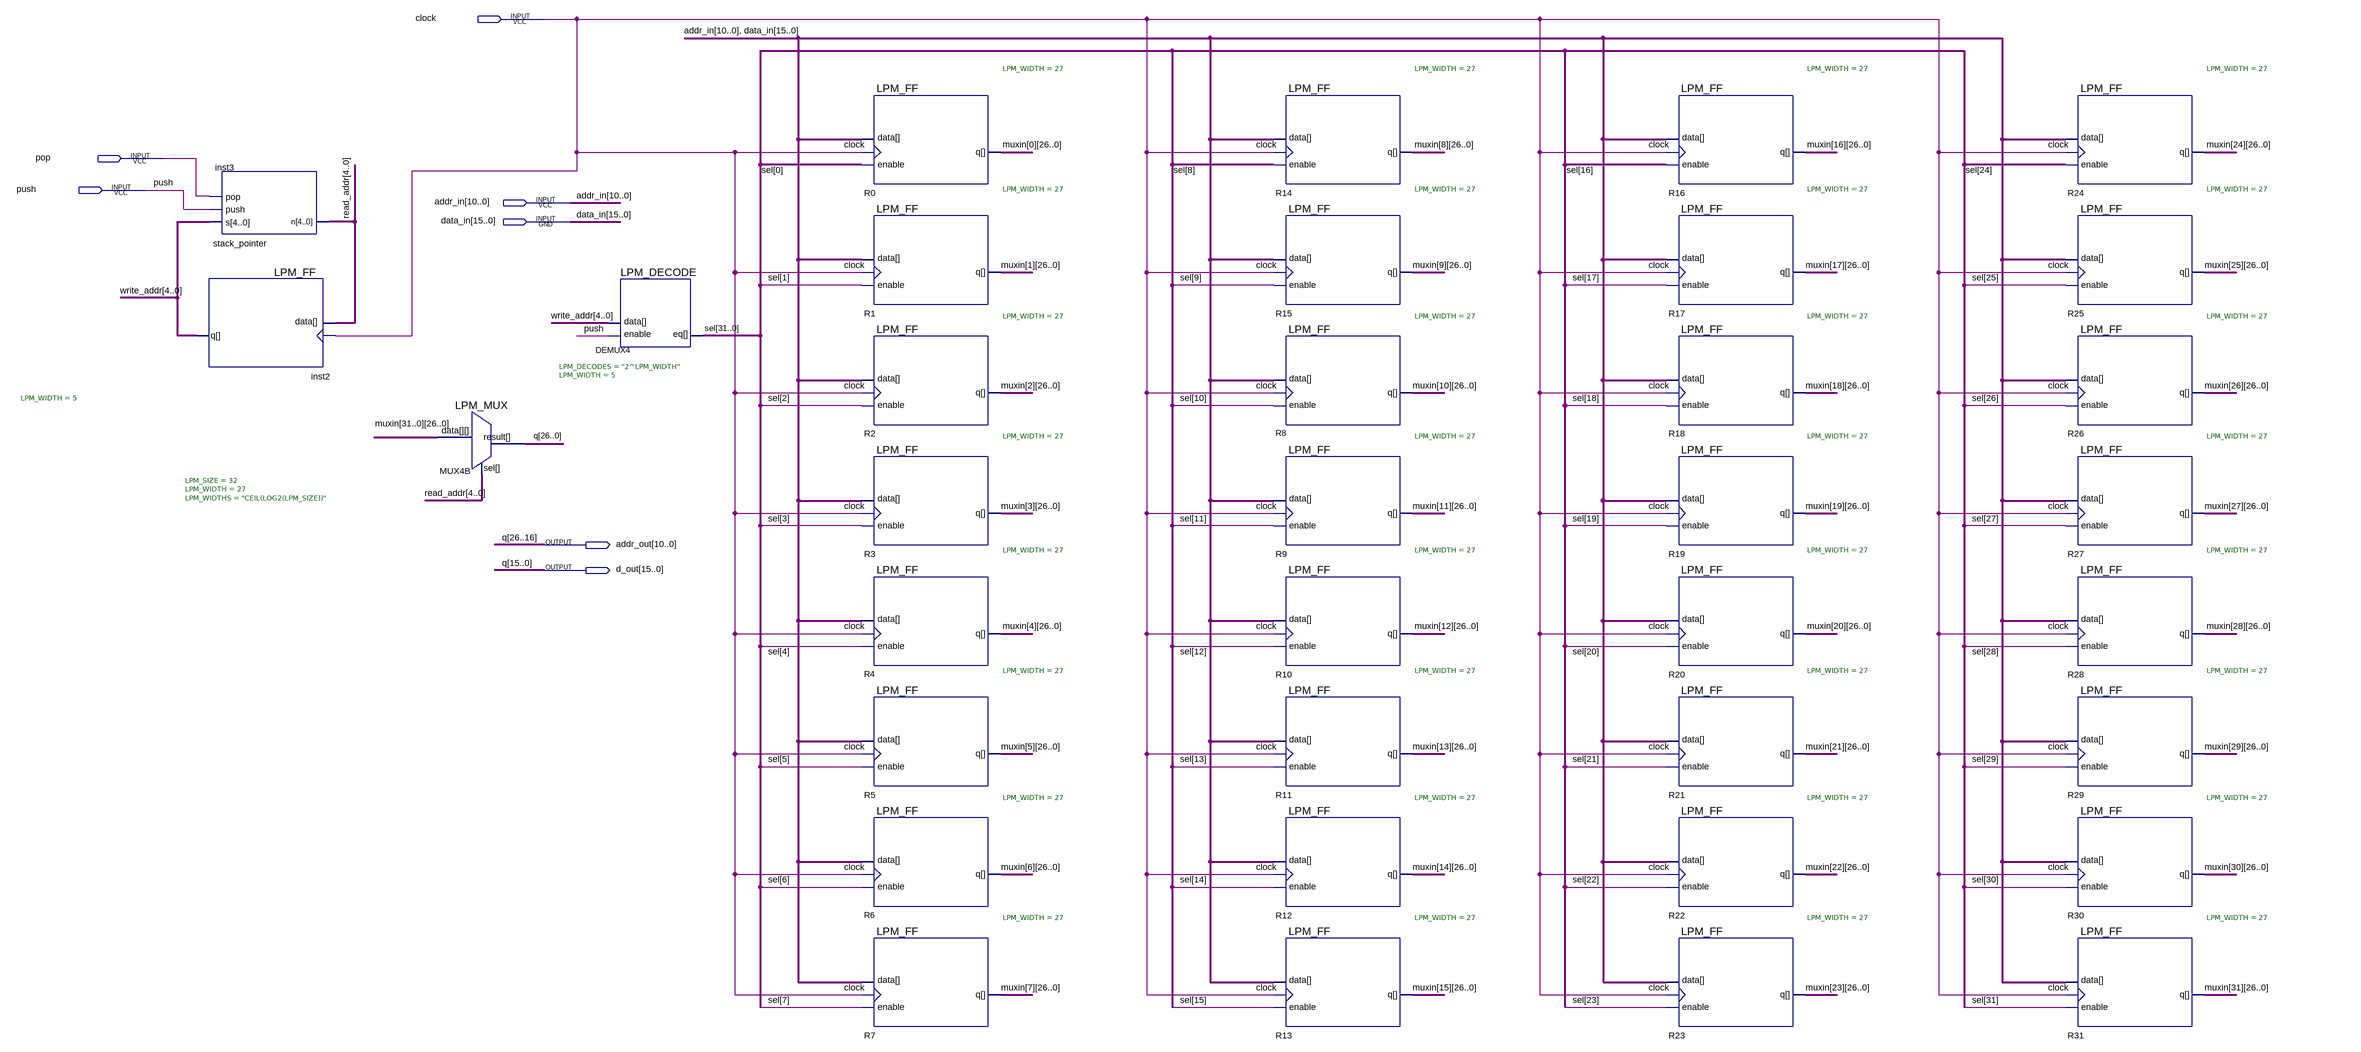
[diagram p0: schematic sheet]
// Quartus schematic stack.bdf as structural Verilog: 36 symbols, 7 pins
module stack (
  input  clock,
  input  pop,
  input  push,
  input  [10:0] addr_in,
  input  [15:0] data_in,
  output [10:0] addr_out,
  output [15:0] d_out
);

  wire [4:0] read_addr, write_addr;
  wire [26:0] muxin_0, muxin_1, muxin_2, muxin_3, muxin_4, muxin_5, muxin_6, muxin_7, muxin_8, muxin_9,
       muxin_10, muxin_11, muxin_12, muxin_13, muxin_14, muxin_15, muxin_16, muxin_17, muxin_18, muxin_19,
       muxin_20, muxin_21, muxin_22, muxin_23, muxin_24, muxin_25, muxin_26, muxin_27, muxin_28, muxin_29,
       muxin_30, muxin_31;
  wire [31:0] sel;

  stack_pointer inst3 (.s(write_addr), .push(push), .pop(pop), .n(read_addr));
  LPM_FF #(.LPM_WIDTH(5)) inst2 (.clock(clock), .data(read_addr), .q(write_addr));
  LPM_MUX #(.LPM_SIZE(32), .LPM_WIDTH(27), .LPM_WIDTHS("CEIL(LOG2(LPM_SIZE))")) MUX4B (
    .data({muxin_31, muxin_30, muxin_29, muxin_28, muxin_27, muxin_26, muxin_25, muxin_24, muxin_23, muxin_22, muxin_21, muxin_20, muxin_19, muxin_18, muxin_17, muxin_16, muxin_15, muxin_14, muxin_13, muxin_12, muxin_11, muxin_10, muxin_9, muxin_8, muxin_7, muxin_6, muxin_5, muxin_4, muxin_3, muxin_2, muxin_1, muxin_0}),
    .sel(read_addr), .result({addr_out, d_out}));
  LPM_DECODE #(.LPM_DECODES("2^LPM_WIDTH"), .LPM_WIDTH(5)) DEMUX4 (.data(write_addr), .enable(push), .eq(sel));
  LPM_FF #(.LPM_WIDTH(27)) R0 (.clock(clock), .data({addr_in, data_in}), .enable(sel[0]), .q(muxin_0));
  LPM_FF #(.LPM_WIDTH(27)) R1 (.clock(clock), .data({addr_in, data_in}), .enable(sel[1]), .q(muxin_1));
  LPM_FF #(.LPM_WIDTH(27)) R2 (.clock(clock), .data({addr_in, data_in}), .enable(sel[2]), .q(muxin_2));
  LPM_FF #(.LPM_WIDTH(27)) R3 (.clock(clock), .data({addr_in, data_in}), .enable(sel[3]), .q(muxin_3));
  LPM_FF #(.LPM_WIDTH(27)) R4 (.clock(clock), .data({addr_in, data_in}), .enable(sel[4]), .q(muxin_4));
  LPM_FF #(.LPM_WIDTH(27)) R5 (.clock(clock), .data({addr_in, data_in}), .enable(sel[5]), .q(muxin_5));
  LPM_FF #(.LPM_WIDTH(27)) R6 (.clock(clock), .data({addr_in, data_in}), .enable(sel[6]), .q(muxin_6));
  LPM_FF #(.LPM_WIDTH(27)) R7 (.clock(clock), .data({addr_in, data_in}), .enable(sel[7]), .q(muxin_7));
  LPM_FF #(.LPM_WIDTH(27)) R14 (.clock(clock), .data({addr_in, data_in}), .enable(sel[8]), .q(muxin_8));
  LPM_FF #(.LPM_WIDTH(27)) R15 (.clock(clock), .data({addr_in, data_in}), .enable(sel[9]), .q(muxin_9));
  LPM_FF #(.LPM_WIDTH(27)) R8 (.clock(clock), .data({addr_in, data_in}), .enable(sel[10]), .q(muxin_10));
  LPM_FF #(.LPM_WIDTH(27)) R9 (.clock(clock), .data({addr_in, data_in}), .enable(sel[11]), .q(muxin_11));
  LPM_FF #(.LPM_WIDTH(27)) R10 (.clock(clock), .data({addr_in, data_in}), .enable(sel[12]), .q(muxin_12));
  LPM_FF #(.LPM_WIDTH(27)) R11 (.clock(clock), .data({addr_in, data_in}), .enable(sel[13]), .q(muxin_13));
  LPM_FF #(.LPM_WIDTH(27)) R12 (.clock(clock), .data({addr_in, data_in}), .enable(sel[14]), .q(muxin_14));
  LPM_FF #(.LPM_WIDTH(27)) R13 (.clock(clock), .data({addr_in, data_in}), .enable(sel[15]), .q(muxin_15));
  LPM_FF #(.LPM_WIDTH(27)) R16 (.clock(clock), .data({addr_in, data_in}), .enable(sel[16]), .q(muxin_16));
  LPM_FF #(.LPM_WIDTH(27)) R17 (.clock(clock), .data({addr_in, data_in}), .enable(sel[17]), .q(muxin_17));
  LPM_FF #(.LPM_WIDTH(27)) R18 (.clock(clock), .data({addr_in, data_in}), .enable(sel[18]), .q(muxin_18));
  LPM_FF #(.LPM_WIDTH(27)) R19 (.clock(clock), .data({addr_in, data_in}), .enable(sel[19]), .q(muxin_19));
  LPM_FF #(.LPM_WIDTH(27)) R20 (.clock(clock), .data({addr_in, data_in}), .enable(sel[20]), .q(muxin_20));
  LPM_FF #(.LPM_WIDTH(27)) R21 (.clock(clock), .data({addr_in, data_in}), .enable(sel[21]), .q(muxin_21));
  LPM_FF #(.LPM_WIDTH(27)) R22 (.clock(clock), .data({addr_in, data_in}), .enable(sel[22]), .q(muxin_22));
  LPM_FF #(.LPM_WIDTH(27)) R23 (.clock(clock), .data({addr_in, data_in}), .enable(sel[23]), .q(muxin_23));
  LPM_FF #(.LPM_WIDTH(27)) R24 (.clock(clock), .data({addr_in, data_in}), .enable(sel[24]), .q(muxin_24));
  LPM_FF #(.LPM_WIDTH(27)) R25 (.clock(clock), .data({addr_in, data_in}), .enable(sel[25]), .q(muxin_25));
  LPM_FF #(.LPM_WIDTH(27)) R26 (.clock(clock), .data({addr_in, data_in}), .enable(sel[26]), .q(muxin_26));
  LPM_FF #(.LPM_WIDTH(27)) R27 (.clock(clock), .data({addr_in, data_in}), .enable(sel[27]), .q(muxin_27));
  LPM_FF #(.LPM_WIDTH(27)) R28 (.clock(clock), .data({addr_in, data_in}), .enable(sel[28]), .q(muxin_28));
  LPM_FF #(.LPM_WIDTH(27)) R29 (.clock(clock), .data({addr_in, data_in}), .enable(sel[29]), .q(muxin_29));
  LPM_FF #(.LPM_WIDTH(27)) R30 (.clock(clock), .data({addr_in, data_in}), .enable(sel[30]), .q(muxin_30));
  LPM_FF #(.LPM_WIDTH(27)) R31 (.clock(clock), .data({addr_in, data_in}), .enable(sel[31]), .q(muxin_31));

  // Other names for the same wires on the sheet: q[26:0] = {addr_out, d_out}
endmodule
